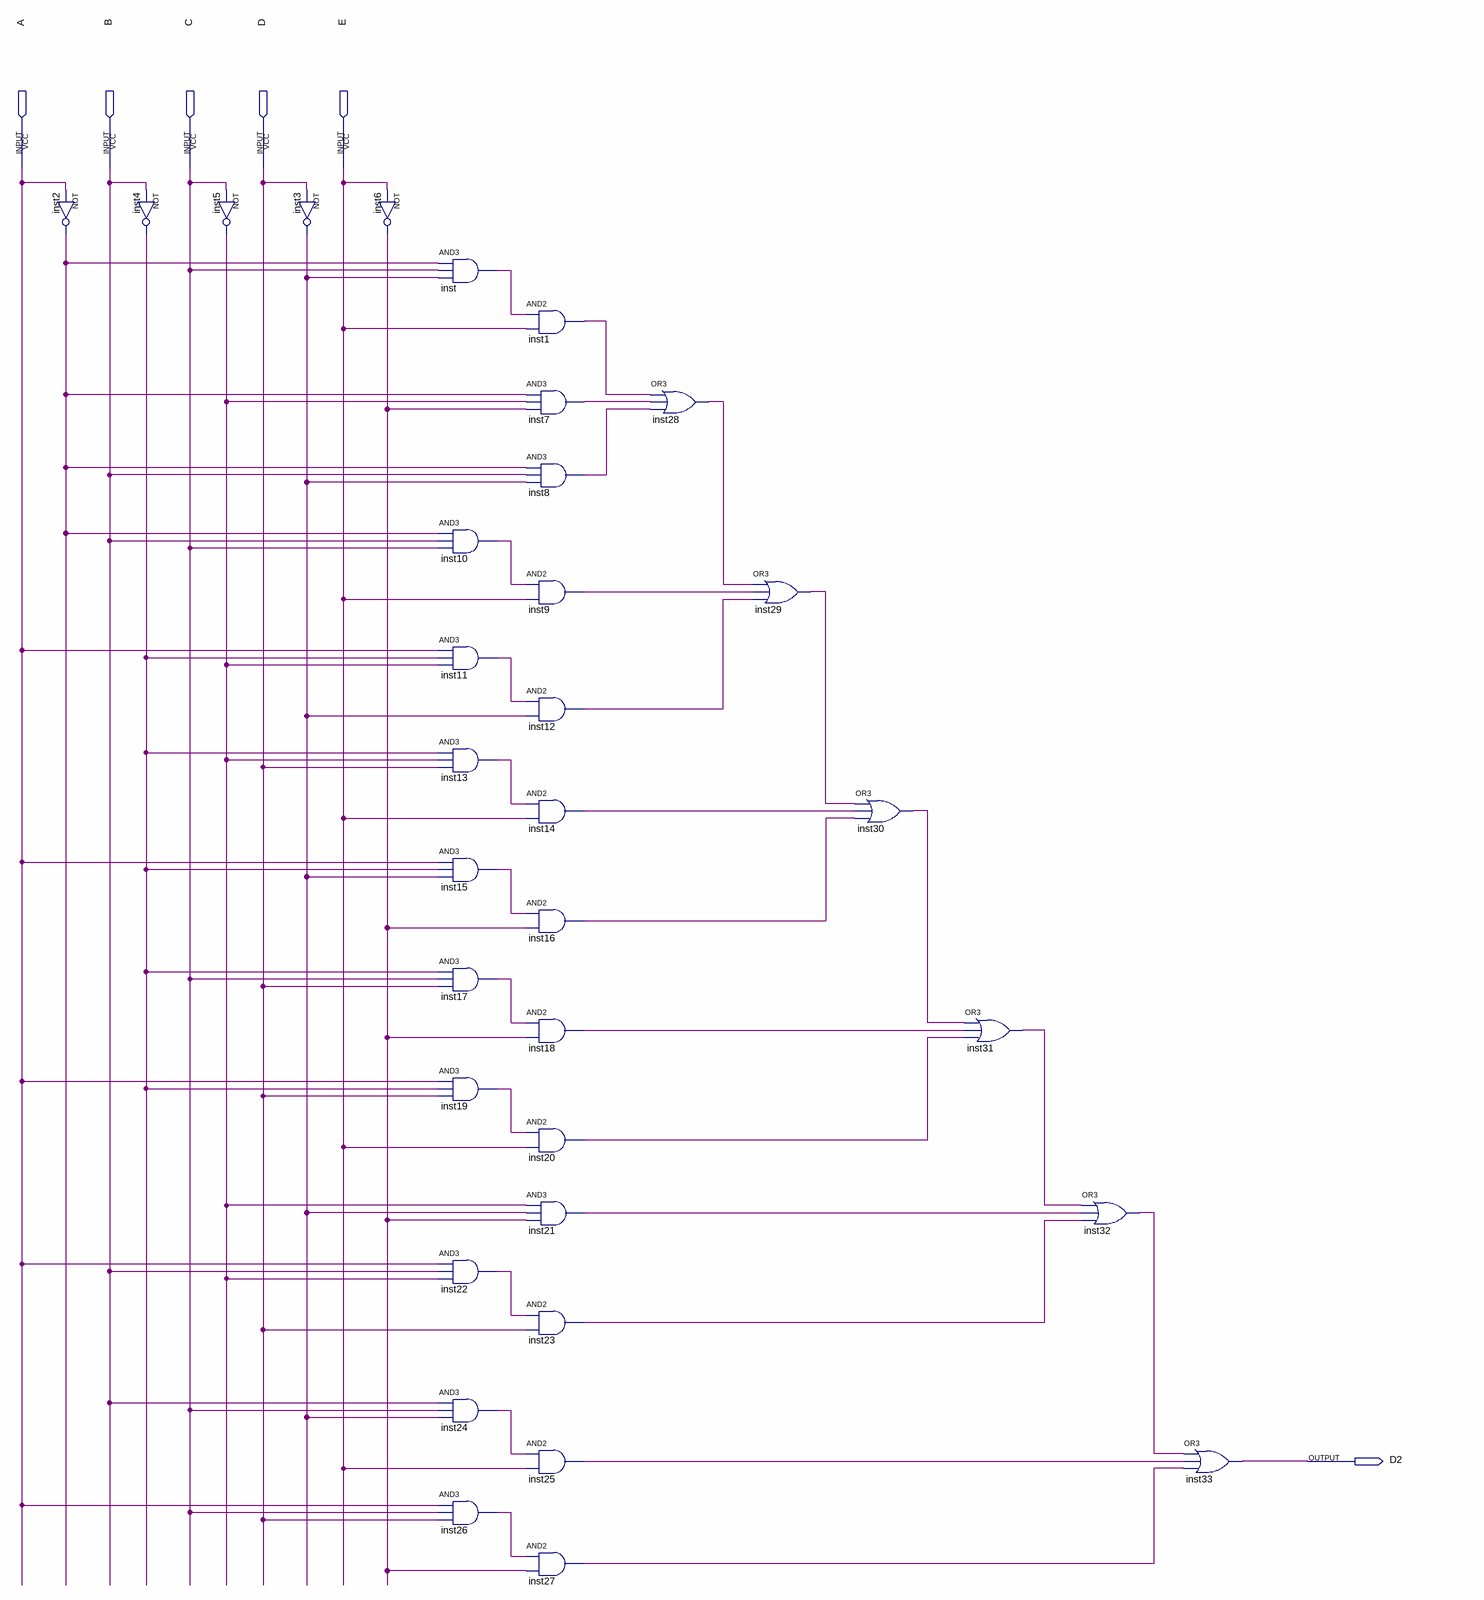
[diagram p0: schematic sheet]
// Quartus schematic led-D2.bdf as structural Verilog: 34 symbols, 6 pins
module \led-D2  (
  input  A,
  input  B,
  input  C,
  input  D,
  input  E,
  output D2
);

  wire inst1_out, inst2_out, inst3_out, inst4_out, inst5_out, inst6_out, inst7_out, inst8_out, inst9_out,
       inst10_out, inst11_out, inst12_out, inst13_out, inst14_out, inst15_out, inst16_out, inst17_out,
       inst18_out, inst19_out, inst20_out, inst21_out, inst22_out, inst23_out, inst24_out, inst25_out,
       inst26_out, inst27_out, inst28_out, inst29_out, inst30_out, inst31_out, inst32_out, inst_out;

  not inst2 (inst2_out, A);
  not inst4 (inst4_out, B);
  not inst5 (inst5_out, C);
  not inst3 (inst3_out, D);
  not inst6 (inst6_out, E);
  and inst (inst_out, inst2_out, C, inst3_out);
  and inst10 (inst10_out, inst2_out, B, C);
  and inst11 (inst11_out, A, inst4_out, inst5_out);
  and inst13 (inst13_out, inst4_out, inst5_out, D);
  and inst15 (inst15_out, A, inst4_out, inst3_out);
  and inst17 (inst17_out, inst4_out, C, D);
  and inst19 (inst19_out, A, inst4_out, D);
  and inst22 (inst22_out, A, B, inst5_out);
  and inst24 (inst24_out, B, C, inst3_out);
  and inst26 (inst26_out, A, C, D);
  and inst1 (inst1_out, inst_out, E);
  and inst7 (inst7_out, inst2_out, inst5_out, inst6_out);
  and inst8 (inst8_out, inst2_out, B, inst3_out);
  and inst9 (inst9_out, inst10_out, E);
  and inst12 (inst12_out, inst11_out, inst3_out);
  and inst14 (inst14_out, inst13_out, E);
  and inst16 (inst16_out, inst15_out, inst6_out);
  and inst18 (inst18_out, inst17_out, inst6_out);
  and inst20 (inst20_out, inst19_out, E);
  and inst21 (inst21_out, inst5_out, inst3_out, inst6_out);
  and inst23 (inst23_out, inst22_out, D);
  and inst25 (inst25_out, inst24_out, E);
  and inst27 (inst27_out, inst26_out, inst6_out);
  or inst28 (inst28_out, inst1_out, inst7_out, inst8_out);
  or inst29 (inst29_out, inst28_out, inst9_out, inst12_out);
  or inst30 (inst30_out, inst29_out, inst14_out, inst16_out);
  or inst31 (inst31_out, inst30_out, inst18_out, inst20_out);
  or inst32 (inst32_out, inst31_out, inst21_out, inst23_out);
  or inst33 (D2, inst32_out, inst25_out, inst27_out);
endmodule
